# Altium schematic sheet Requirements.SchDoc
size B; SheetNumber: 1; SheetTotal: 7
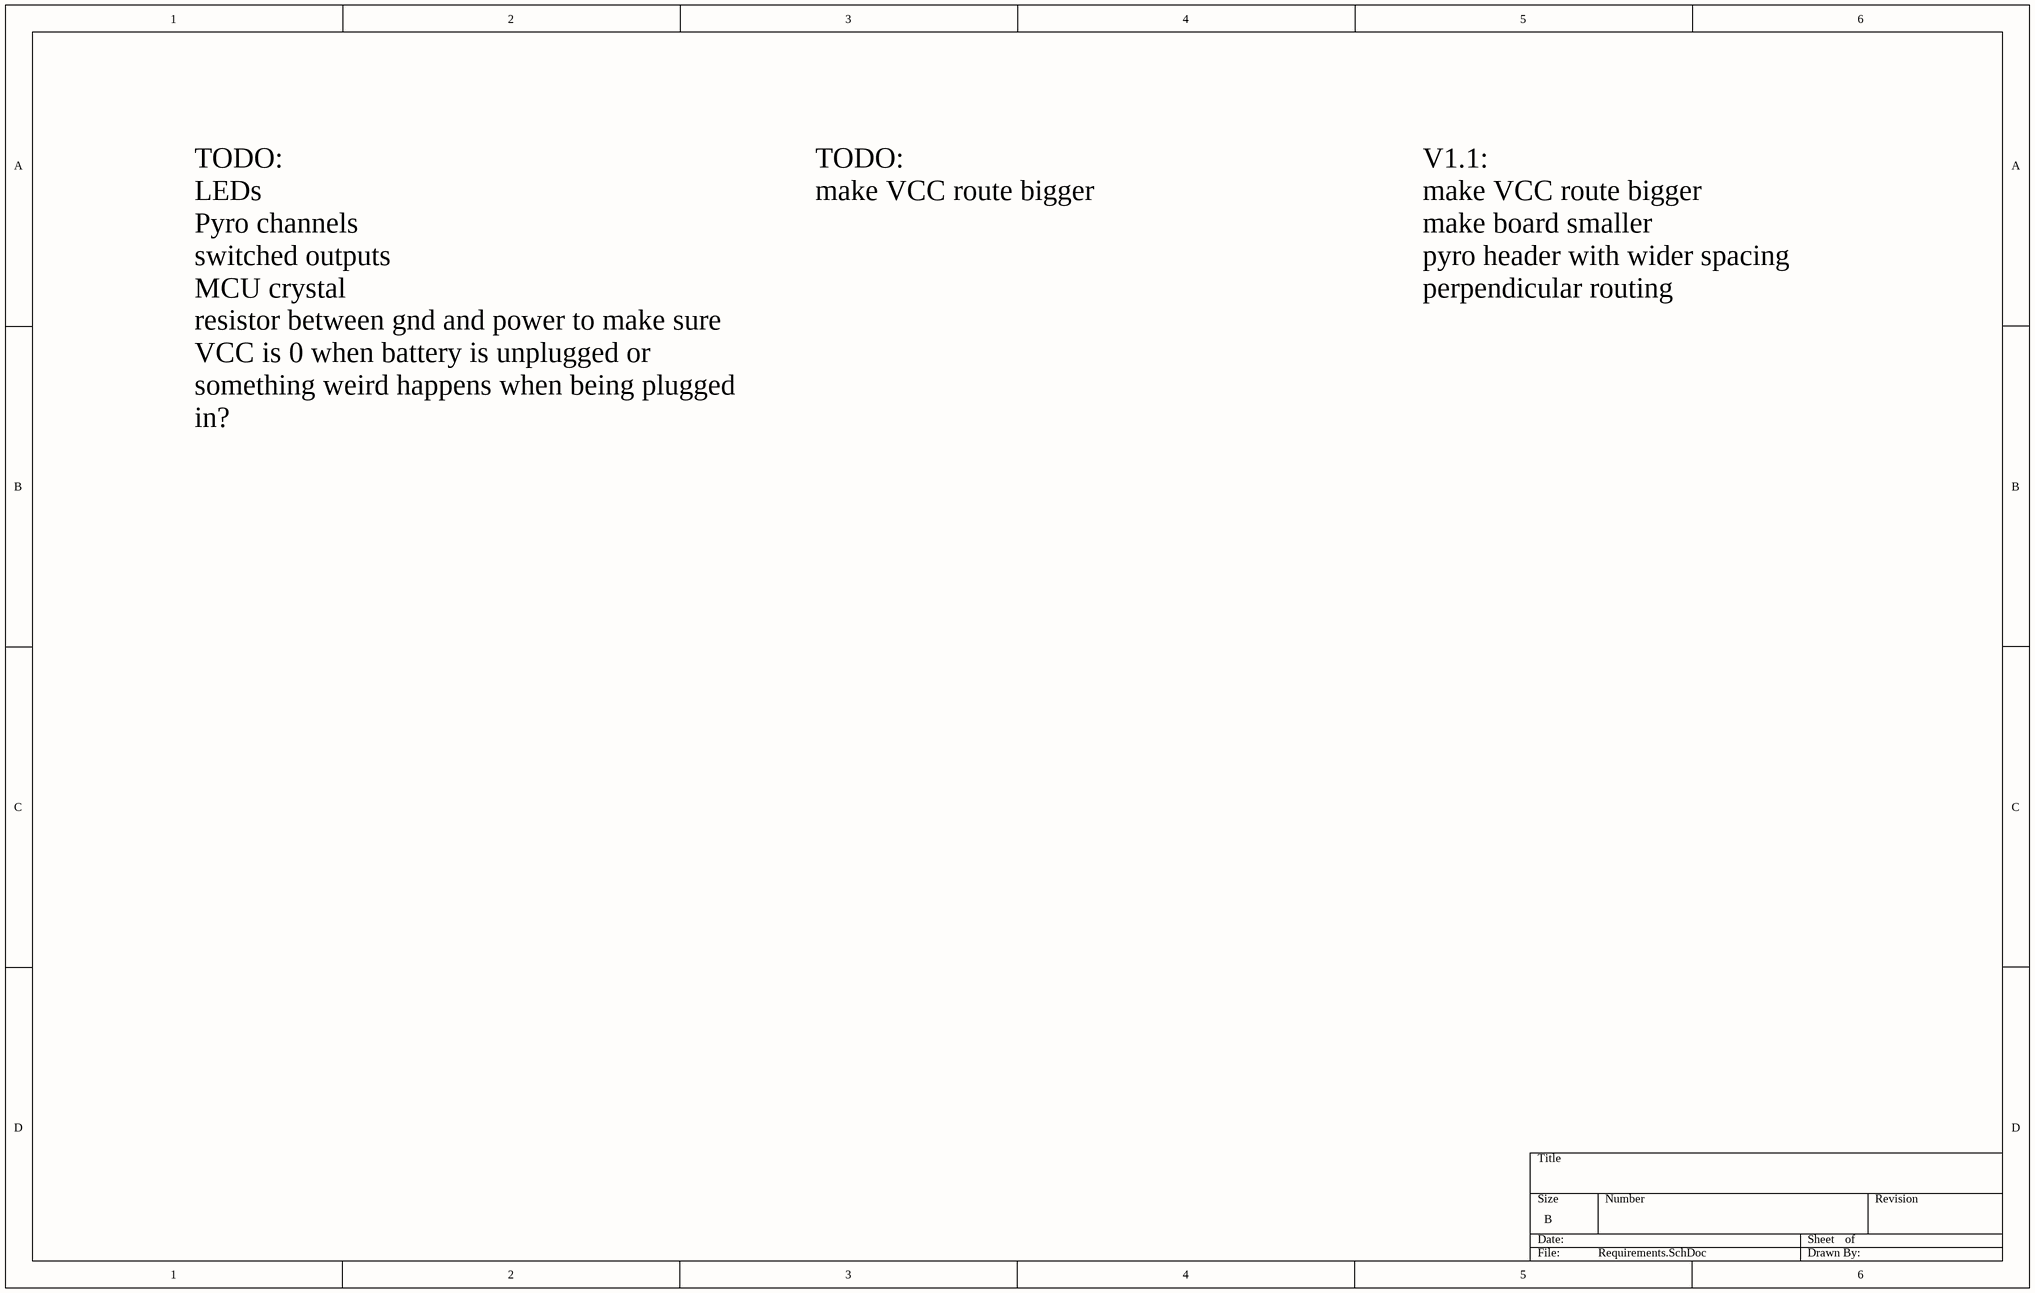
[diagram p0: Requirements.SchDoc]

## Notes on the sheet
- TODO:
  LEDs
  Pyro channels
  switched outputs
  MCU crystal
  resistor between gnd and power to make sure VCC is 0 when battery is unplugged or something weird happens when being plugged in?
- TODO:
  make VCC route bigger
- V1.1:
  make VCC route bigger
  make board smaller
  pyro header with wider spacing
  perpendicular routing